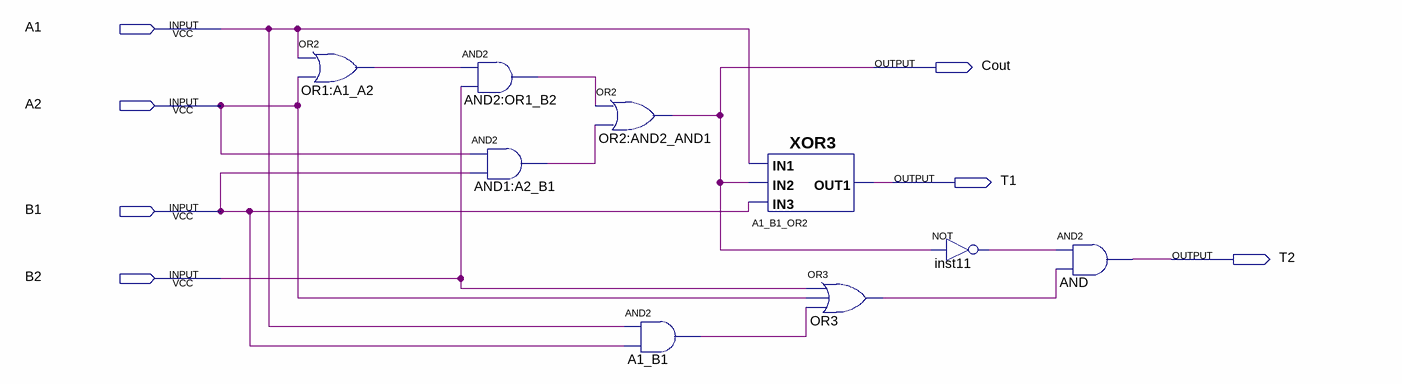
[diagram p0: schematic sheet]
// Quartus schematic HALF_ADDER.bdf as structural Verilog: 9 symbols, 7 pins
module HALF_ADDER (
  input  A1,
  input  A2,
  input  B1,
  input  B2,
  output Cout,
  output T1,
  output T2
);

  wire A1_B1_out, AND1_A2_B1_out, AND2_OR1_B2_out, inst11_out, OR1_A1_A2_out, OR3_out;

  or \OR1:A1_A2  (OR1_A1_A2_out, A1, A2);
  and \AND2:OR1_B2  (AND2_OR1_B2_out, OR1_A1_A2_out, B2);
  and \AND1:A2_B1  (AND1_A2_B1_out, A2, B1);
  or \OR2:AND2_AND1  (Cout, AND2_OR1_B2_out, AND1_A2_B1_out);
  and A1_B1 (A1_B1_out, A1, B1);
  XOR3 A1_B1_OR2 (.IN3(B1), .IN1(A1), .IN2(Cout), .OUT1(T1));
  or OR3 (OR3_out, B2, A2, A1_B1_out);
  not inst11 (inst11_out, Cout);
  and AND (T2, inst11_out, OR3_out);
endmodule
